# EAGLE schematic Motor_circuit (EAGLE 9.6.2)
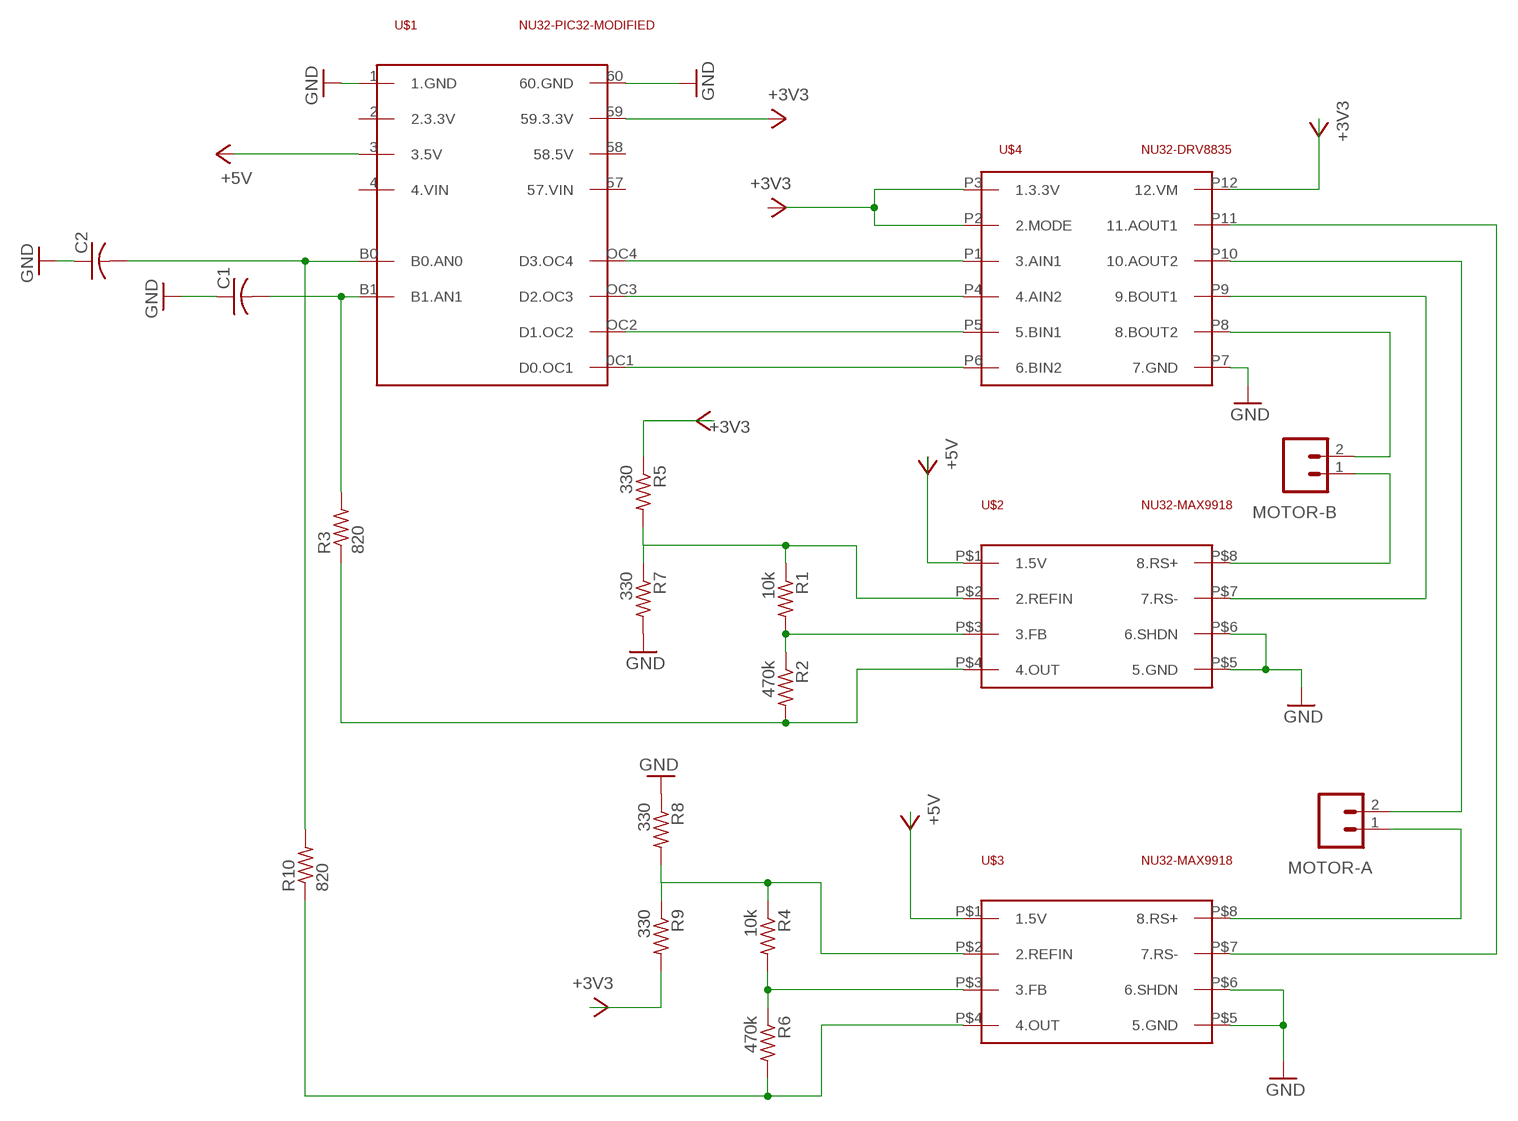
[diagram p0: schematic, sheet 1]

## Parts
C1  C-US050-050X075  [C050-050X075]
C2  C-US050-050X075  [C050-050X075]
MOTOR-A  CONN_02  [1X02]
MOTOR-B  CONN_02  [1X02]
R1  10k  R-US_0207/10  [0207/10]
R2  470k  R-US_0207/10  [0207/10]
R3  820  R-US_0207/10  [0207/10]
R4  10k  R-US_0207/10  [0207/10]
R5  330  R-US_0207/10  [0207/10]
R6  470k  R-US_0207/10  [0207/10]
R7  330  R-US_0207/10  [0207/10]
R8  330  R-US_0207/10  [0207/10]
R9  330  R-US_0207/10  [0207/10]
R10  820  R-US_0207/10  [0207/10]
U$1  NU32-PIC32-MODIFIED  [NU32-PIC32-MODIFIED]
U$2  NU32-MAX9918  [NU32-MAX9918]
U$3  NU32-MAX9918  [NU32-MAX9918]
U$4  NU32-DRV8835  [NU32-DRV8835]

## Nets
+3V3: R5.1 R9.2 U$1.59(59.3.3V) U$4.P12(12.VM)
+5V: U$1.3(3.5V) U$2.P$1(1.5V) U$3.P$1(1.5V)
GND: C2.1 R7.2 R8.1 U$1.1(1.GND) U$1.60(60.GND) U$2.P$5(5.GND) U$2.P$6(6.SHDN) U$3.P$5(5.GND) U$3.P$6(6.SHDN) U$4.P7(7.GND)
N$1: U$4.P2(2.MODE) U$4.P3(1.3.3V)
N$2: U$1.OC4(D3.OC4) U$4.P1(3.AIN1)
N$3: U$1.OC3(D2.OC3) U$4.P4(4.AIN2)
N$4: U$1.OC2(D1.OC2) U$4.P5(5.BIN1)
N$5: U$2.P$7(7.RS-) U$4.P9(9.BOUT1)
N$6: U$3.P$7(7.RS-) U$4.P11(11.AOUT1)
N$7: U$1.0C1(D0.OC1) U$4.P6(6.BIN2)
N$8: R1.2 R2.1 U$2.P$3(3.FB)
N$9: R1.1 R5.2 R7.1 U$2.P$2(2.REFIN)
N$10: R2.2 R3.1 U$2.P$4(4.OUT)
N$11: C1.2 R3.2 U$1.B1(B1.AN1)
N$12: C1.1 ; supply symbol labelled GND
N$13: R4.2 R6.1 U$3.P$3(3.FB)
N$14: R4.1 R8.2 R9.1 U$3.P$2(2.REFIN)
N$15: R6.2 R10.1 U$3.P$4(4.OUT)
N$16: C2.2 R10.2 U$1.B0(B0.AN0)
N$17: MOTOR-B.1 U$2.P$8(8.RS+)
N$18: MOTOR-A.2 U$4.P10(10.AOUT2)
N$19: MOTOR-B.2 U$4.P8(8.BOUT2)
N$20: MOTOR-A.1 U$3.P$8(8.RS+)
Unconnected: U$1.2(2.3.3V) U$1.4(4.VIN) U$1.57(57.VIN) U$1.58(58.5V)

## Library data of the parts
C1 C2 = Final_Project_lib:C-US: CAPACITOR, American symbol; SPICEPREFIX: C
MOTOR-A MOTOR-B = Final_Project_lib:CONN_02: Multi connection point. Often used as Generic Header-pin footprint for 0.1 inch spaced/style header connections On any of the 0.1 inch spaced packages, you can populate with these: Break Away Headers - Straight <https://www.sparkfun.com/products/116> (PRT-00116) Break Away Male Headers - Right Angle <https://www.sparkfun.com/products/553> (PRT-00553) Female Headers <https://www.sparkfun.com/products/115> (PRT-00115) Break Away Headers - Machine Pin <https://www.sparkfun.com/products/117> (PRT-00117) Break Away Female Headers - Swiss Machine Pin <https://www.sparkfun.com/products/743> (PRT-00743) For SCREWTERMINALS and SPRING TERMINALS visit here: Screw Terimnals on SparkFun.com <https://www.sparkfun.com/search/results?term=Screw+Terminals> (5mm/3.5mm/2.54mm spacing) This device is also useful as a general connection point to wire up your design to another part of your project. Our various solder wires solder well into these plated through hole pads. Hook-Up Wire - Assortment (Stranded, 22 AWG) <https://www.sparkfun.com/products/11375> (PRT-11375) Hook-Up Wire - Assortment (Solid Core, 22 AWG) <https://www.sparkfun.com/products/11367> (PRT-11367) View the entire wire category on our website here <https://www.sparkfun.com/categories/141> Special notes: Molex polarized connector foot print use with: PRT-08233 with associated crimp pins and housings. 2.54_SCREWTERM for use with PRT-10571. 3.5mm Screw Terminal footprints for PRT-08084 5mm Screw Terminal footprints for use with PRT-08432
R1-R10 = Final_Project_lib:R-US_: RESISTOR, American symbol; SPICEPREFIX: R
U$1 = Final_Project_lib:NU32-PIC32-MODIFIED
U$2 U$3 = Final_Project_lib:NU32-MAX9918
U$4 = Final_Project_lib:NU32-DRV8835